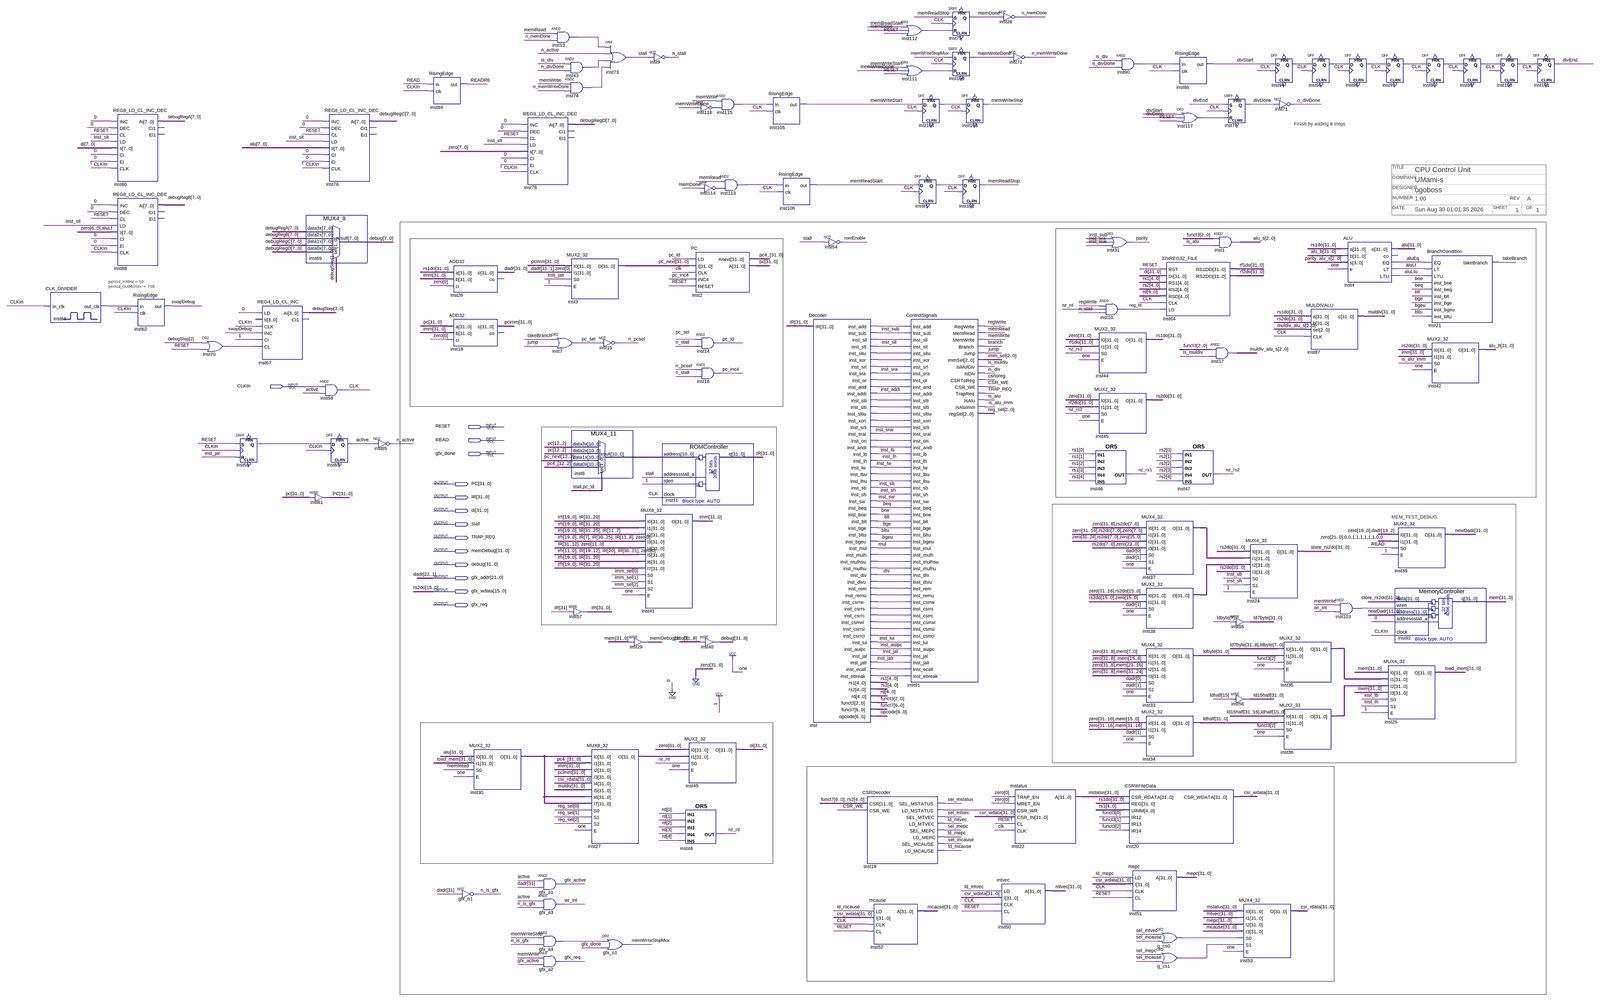
[diagram p0: schematic sheet, whole]
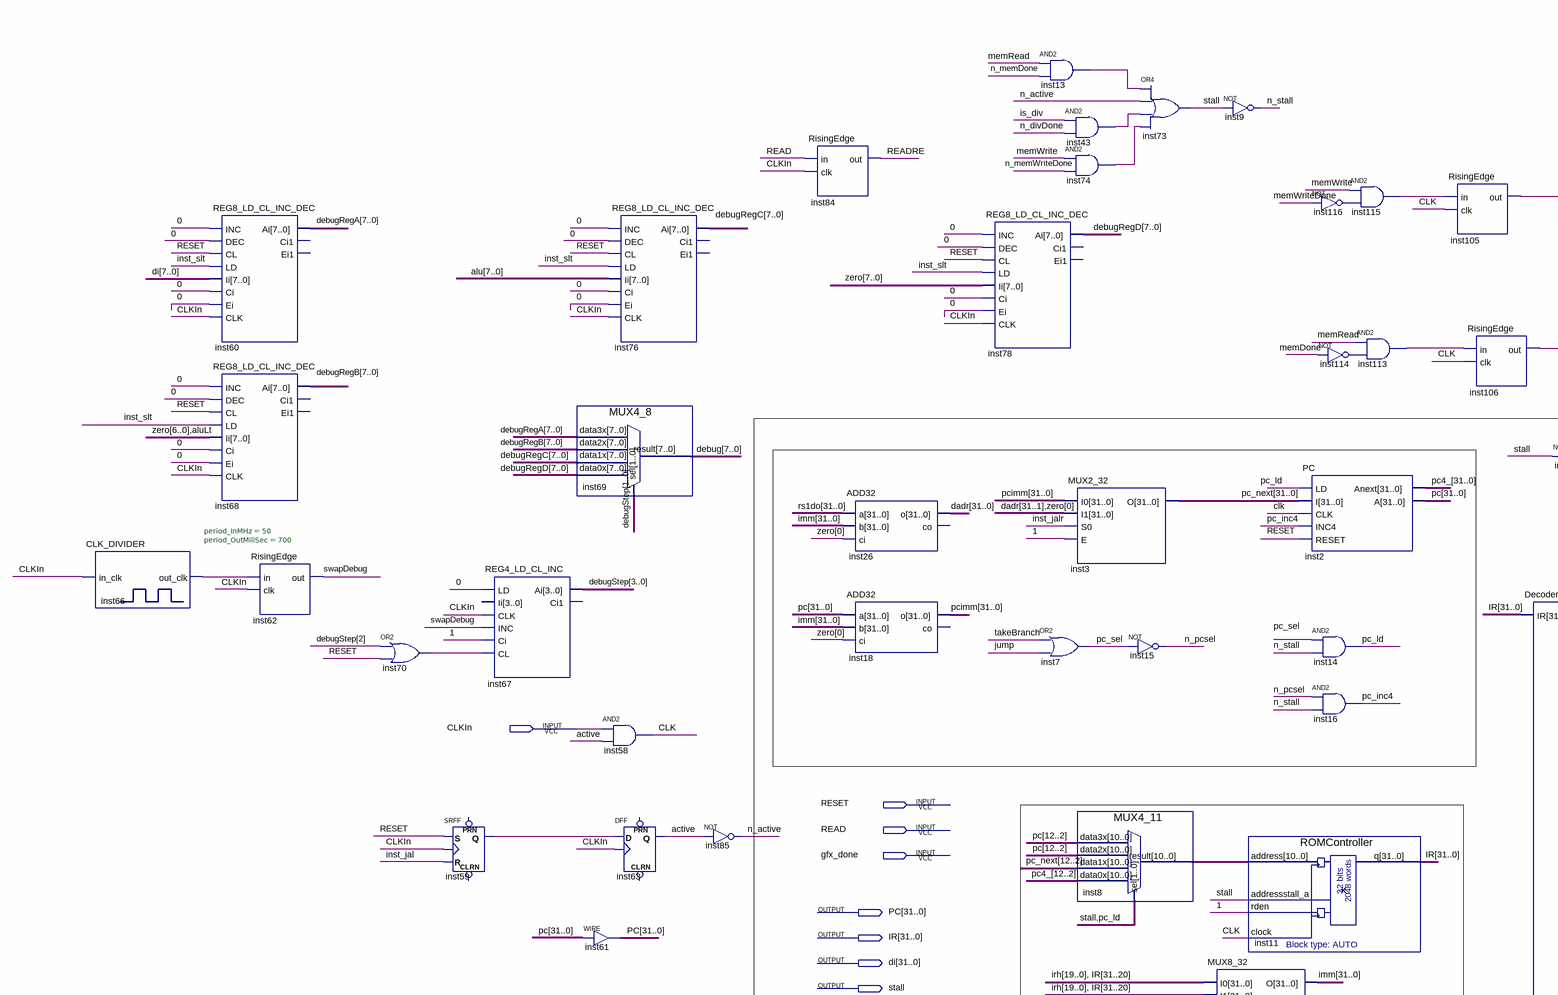
[diagram p1: schematic sheet, upper left part]
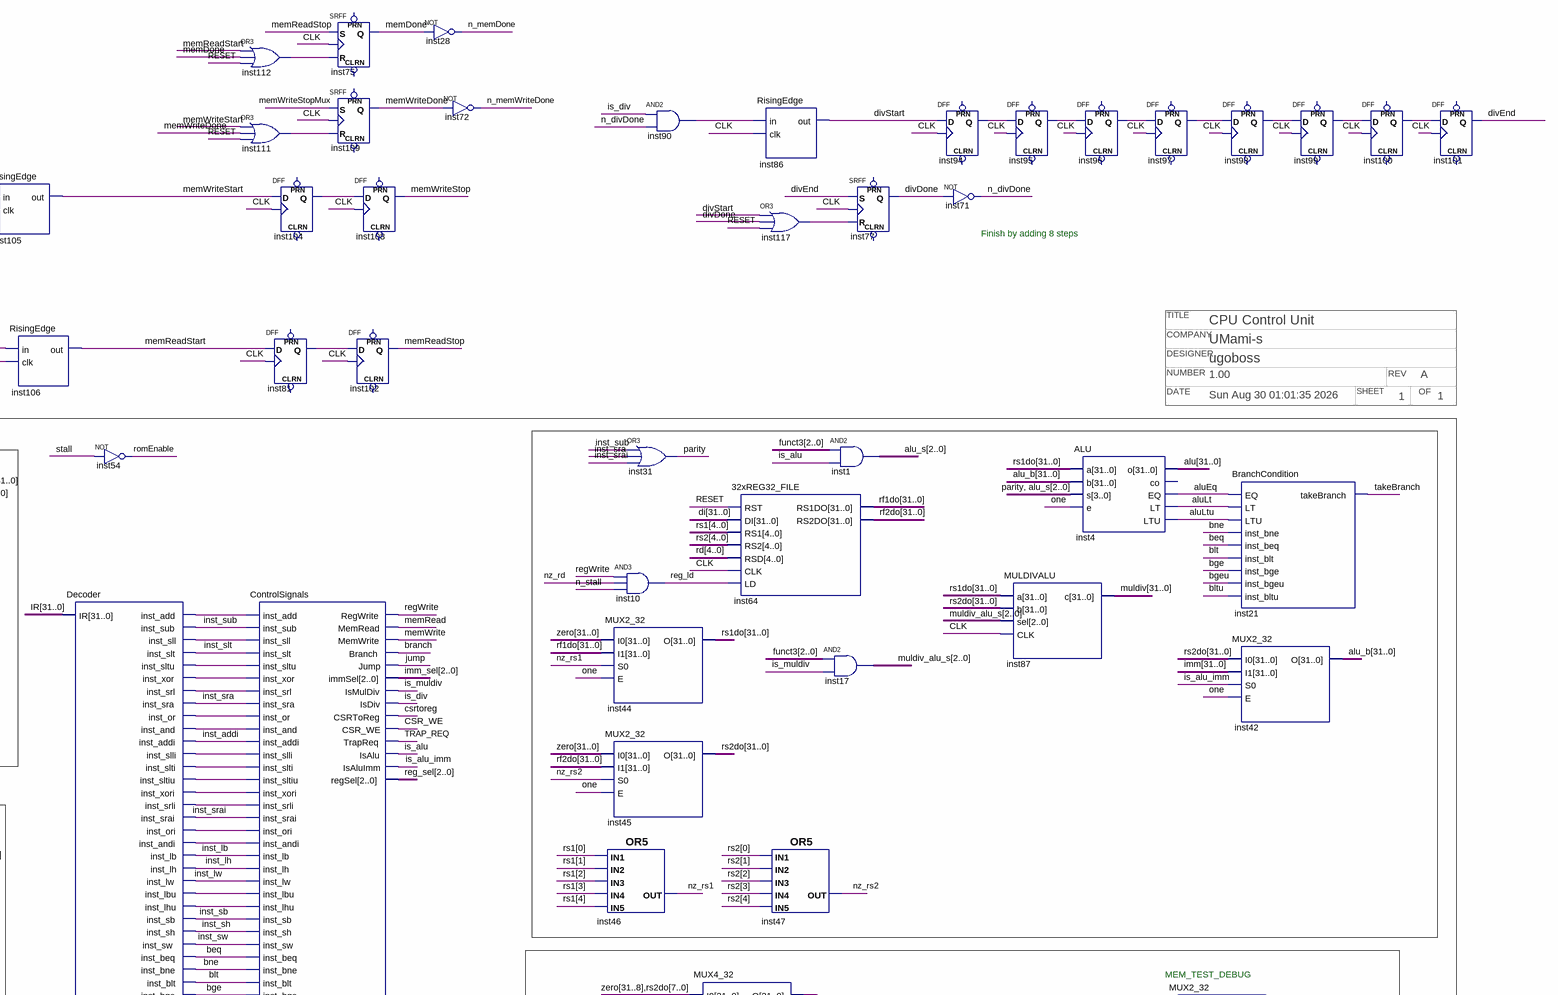
[diagram p2: schematic sheet, upper right part]
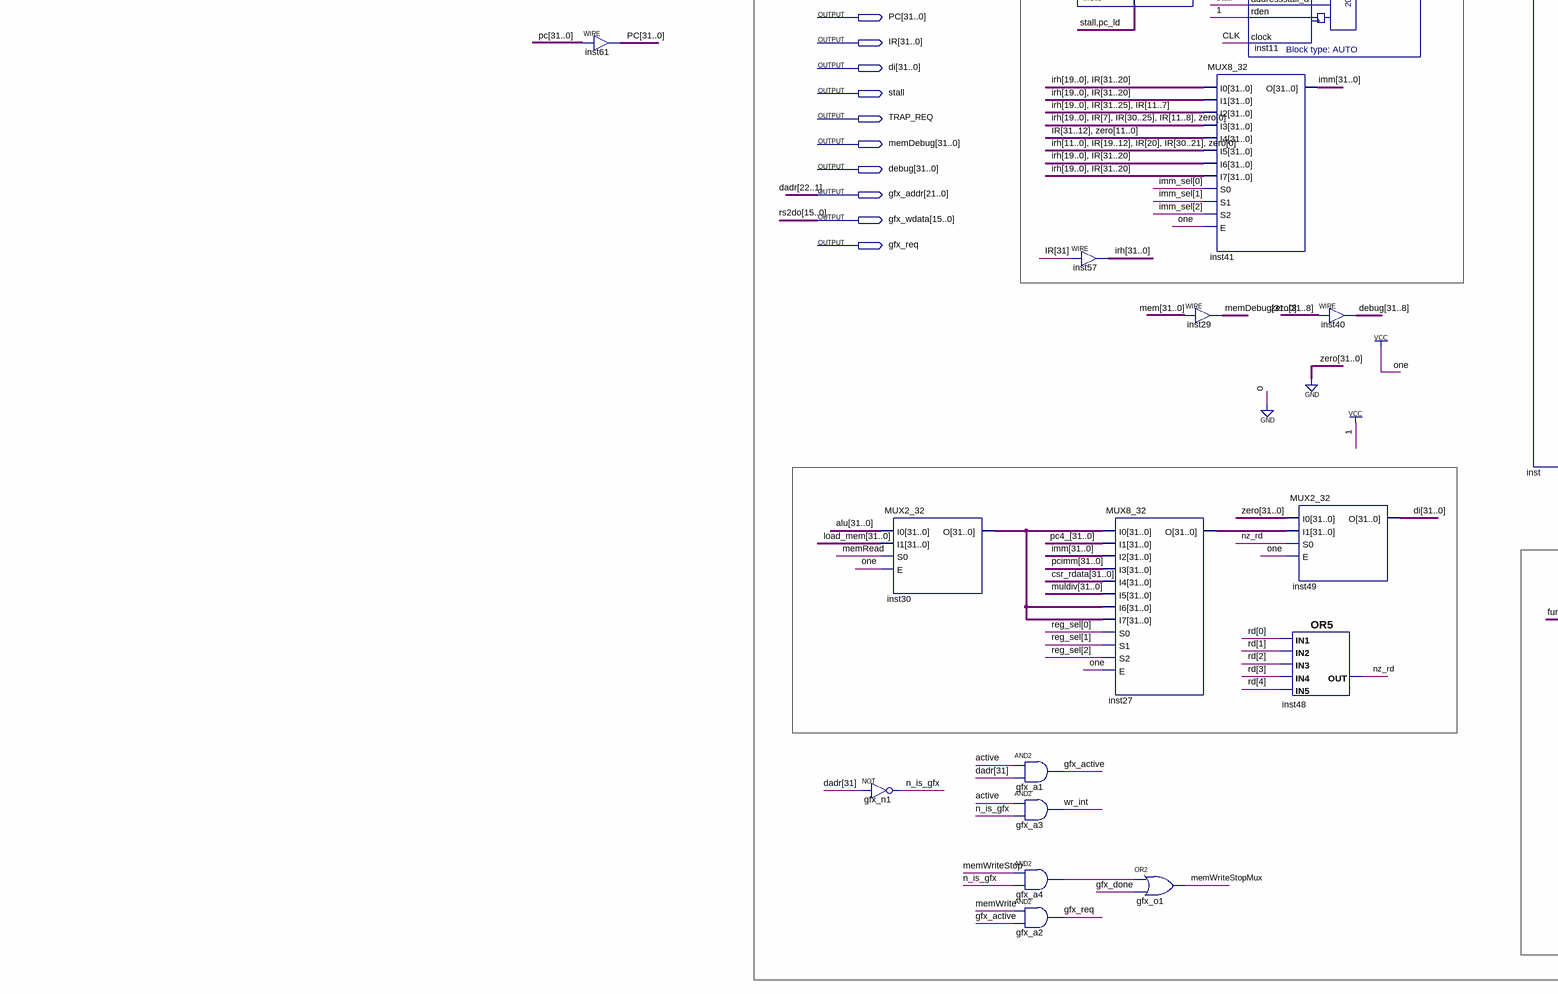
[diagram p3: schematic sheet, lower left part]
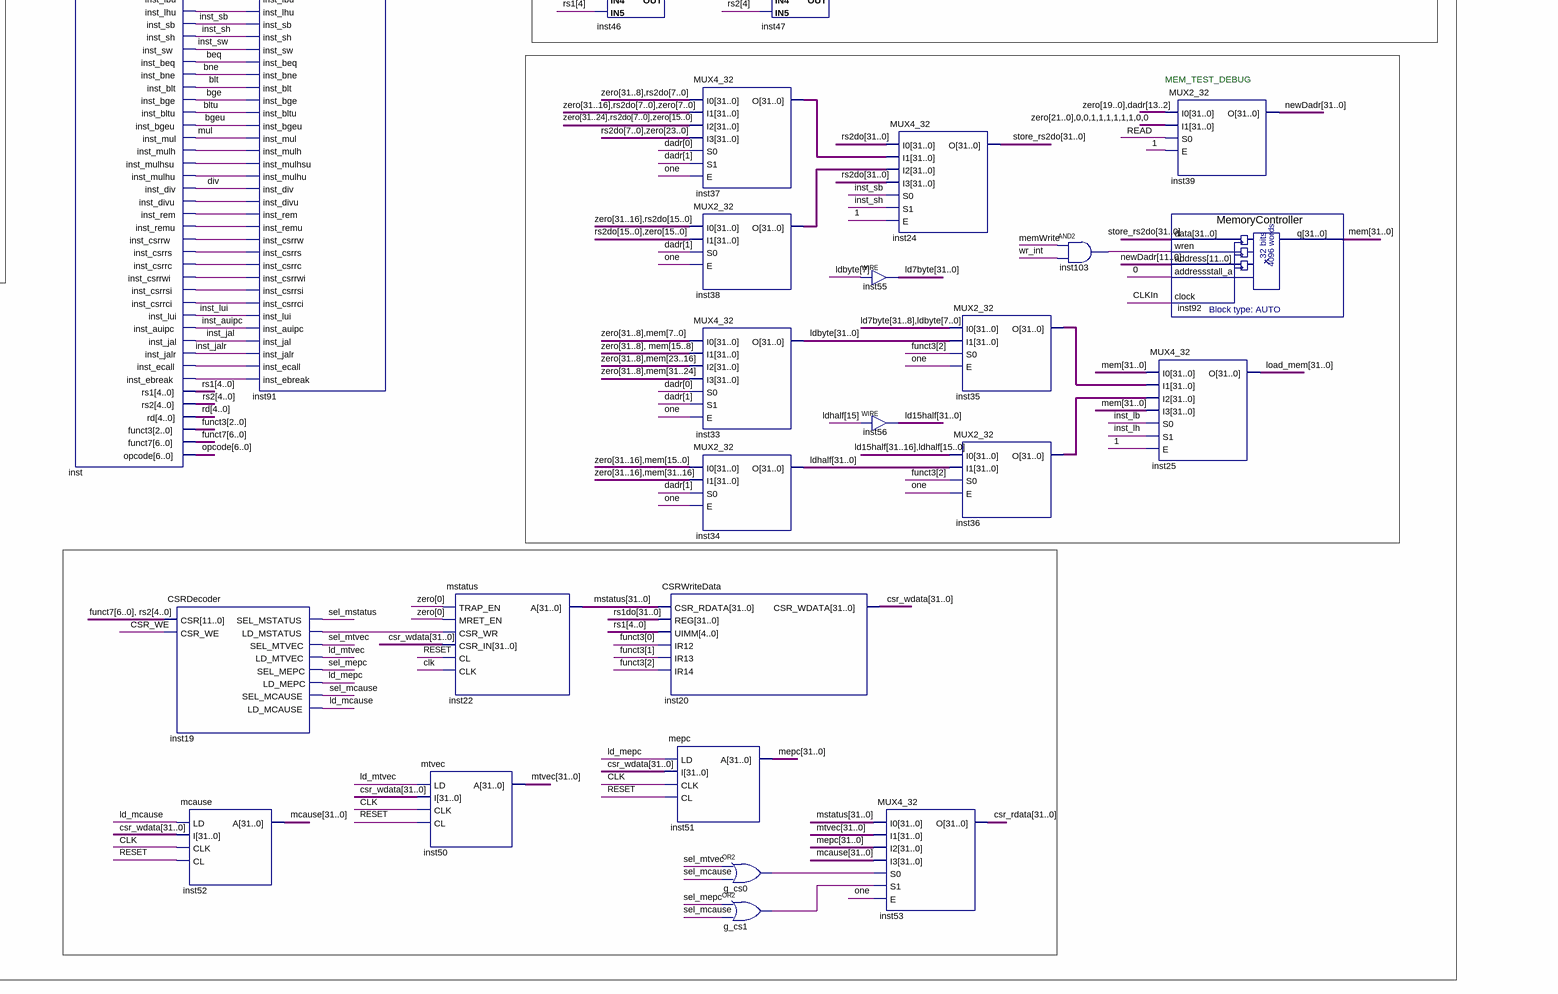
[diagram p4: schematic sheet, lower right part]
// Quartus schematic ControlUnit.bdf as structural Verilog: 111 symbols, 14 pins
// Title block: COMPANY: UMami-s; DATE: Sun Aug 30 01:01:35 2026; DESIGNER: ugoboss; NUMBER: 1.00; OF: 1; REV: A; SHEET: 1; TITLE: CPU Control Unit
module ControlUnit (
  input  CLKIn,
  input  RESET,
  input  READ,
  input  gfx_done,
  output [31:0] PC,
  output [31:0] IR,
  output [31:0] di,
  output stall,
  output TRAP_REQ,
  output [31:0] memDebug,
  output [31:0] debug,
  output [21:0] gfx_addr,
  output [15:0] gfx_wdata,
  output gfx_req
);

  wire active, aluEq, aluLt, aluLtu, beq, bge, bgeu, blt, bltu, bne, branch, CLK, CSR_WE, csrtoreg, div,
       divDone, divEnd, divStart, g_cs0_out, g_cs1_out, gfx_a4_out, gfx_active, inst13_out,
       inst19_ld_mstatus, inst43_out, inst59_q, inst66_out_clk, inst70_out, inst74_out, inst81_q, inst90_out,
       inst94_q, inst95_q, inst96_q, inst97_q, inst98_q, inst99_q, inst100_q, inst103_out, inst104_q,
       inst111_out, inst112_out, inst113_out, inst114_out, inst115_out, inst116_out, inst117_out, inst_addi,
       inst_auipc, inst_inst_add, inst_inst_and, inst_inst_andi, inst_inst_csrrc, inst_inst_csrrci,
       inst_inst_csrrs, inst_inst_csrrsi, inst_inst_csrrw, inst_inst_csrrwi, inst_inst_divu,
       inst_inst_ebreak, inst_inst_ecall, inst_inst_lbu, inst_inst_lhu, inst_inst_mulh, inst_inst_mulhsu,
       inst_inst_mulhu, inst_inst_or, inst_inst_ori, inst_inst_rem, inst_inst_remu, inst_inst_sll,
       inst_inst_slli, inst_inst_slti, inst_inst_sltiu, inst_inst_sltu, inst_inst_srl, inst_inst_srli,
       inst_inst_xor, inst_inst_xori, inst_jal, inst_jalr, inst_lb, inst_lh, inst_lui, inst_lw, inst_sb,
       inst_sh, inst_slt, inst_sra, inst_srai, inst_sub, inst_sw, is_alu, is_alu_imm, is_div, is_muldiv,
       jump, ld_mcause, ld_mepc, ld_mtvec, memDone, memRead, memReadStart, memReadStop, memWrite,
       memWriteDone, memWriteStart, memWriteStop, memWriteStopMux, mul, n_active, n_divDone, n_is_gfx,
       n_memDone, n_memWriteDone, n_pcsel, n_stall, nz_rd, nz_rs1, nz_rs2, parity, pc_inc4, pc_ld, pc_sel,
       READRE, reg_ld, regWrite, romEnable, sel_mcause, sel_mepc, sel_mstatus, sel_mtvec, swapDebug,
       takeBranch, wr_int;
  wire [2:0] alu_s, funct3, imm_sel, muldiv_alu_s, reg_sel;
  wire [3:0] debugStep;
  wire [4:0] rd, rs1, rs2;
  wire [6:0] funct7, opcode;
  wire [7:0] debugRegA, debugRegB, debugRegC, debugRegD;
  wire [10:0] inst8_result;
  wire [31:0] alu, alu_b, csr_rdata, csr_wdata, dadr, imm, inst27_o, inst30_o, inst35_o, inst36_o, inst37_o,
       inst38_o, irh, ld7byte, ld15half, ldbyte, ldhalf, load_mem, mcause, mem, mepc, mstatus, mtvec, muldiv,
       newDadr, pc4_, pc_next, pcimm, rf1do, rf2do, rs1do, store_rs2do;
  wire [31:16] rs2do;

  CLK_DIVIDER #(.period_InMHz(50), .period_OutMiliSec(700)) inst66 (.in_clk(CLKIn), .out_clk(inst66_out_clk));
  REG8_LD_CL_INC_DEC inst60 (
    .INC(1'b0), .DEC(1'b0), .CL(RESET), .LD(inst_slt), .Ii(di[7:0]), .Ci(1'b0), .Ei(1'b0), .CLK(CLKIn),
    .Ai(debugRegA));  // open: Ci1, Ei1
  REG8_LD_CL_INC_DEC inst68 (
    .INC(1'b0), .DEC(1'b0), .CL(RESET), .LD(inst_slt), .Ii({{7{1'b0}}, aluLt}), .Ci(1'b0), .Ei(1'b0),
    .CLK(CLKIn), .Ai(debugRegB));  // open: Ci1, Ei1
  RisingEdge inst62 (.in(inst66_out_clk), .clk(CLKIn), .out(swapDebug));
  or inst70 (inst70_out, debugStep[2], RESET);
  REG4_LD_CL_INC inst67 (
    .LD(1'b0), .CLK(CLKIn), .INC(swapDebug), .Ci(1'b1), .CL(inst70_out), .Ai(debugStep));  // open: Ii, Ci1
  SRFF inst59 (.S(RESET), .R(inst_jal), .CLK(CLKIn), .Q(inst59_q));  // open: PRN, CLRN
  MUX4_8 inst69 (
    .data3x(debugRegA), .data2x(debugRegB), .data1x(debugRegC), .data0x(debugRegD), .sel(debugStep[1:0]),
    .result(debug[7:0]));
  assign PC = PC;  // WIRE inst61
  REG8_LD_CL_INC_DEC inst76 (
    .INC(1'b0), .DEC(1'b0), .CL(RESET), .LD(inst_slt), .Ii(alu[7:0]), .Ci(1'b0), .Ei(1'b0), .CLK(CLKIn),
    .Ai(debugRegC));  // open: Ci1, Ei1
  and inst58 (CLK, CLKIn, active);
  DFF inst63 (.CLK(CLKIn), .D(inst59_q), .Q(active));  // open: CLRN, PRN
  not inst85 (n_active, active);
  RisingEdge inst84 (.in(READ), .clk(CLKIn), .out(READRE));
  ADD32 inst26 (.a(rs1do), .b(imm), .ci(1'b0), .o({dadr[31:23], gfx_addr, dadr[0]}));  // open: co
  ADD32 inst18 (.a(PC), .b(imm), .ci(1'b0), .o(pcimm));  // open: co
  MUX2_32 inst30 (.I0(alu), .I1(load_mem), .S0(memRead), .E(1'b1), .O(inst30_o));
  not gfx_n1 (n_is_gfx, dadr[31]);
  REG8_LD_CL_INC_DEC inst78 (
    .INC(1'b0), .DEC(1'b0), .CL(RESET), .LD(inst_slt), .Ii({8{1'b0}}), .Ci(1'b0), .Ei(1'b0), .CLK(CLKIn),
    .Ai(debugRegD));  // open: Ci1, Ei1
  and inst13 (inst13_out, memRead, n_memDone);
  or inst7 (pc_sel, takeBranch, jump);
  and gfx_a1 (gfx_active, active, dadr[31]);
  and gfx_a3 (wr_int, active, n_is_gfx);
  and gfx_a4 (gfx_a4_out, memWriteStop, n_is_gfx);
  and gfx_a2 (gfx_req, memWrite, gfx_active);
  and inst43 (inst43_out, is_div, n_divDone);
  and inst74 (inst74_out, memWrite, n_memWriteDone);
  MUX2_32 inst3 (.I0(pcimm), .I1({dadr[31:23], gfx_addr, 1'b0}), .S0(inst_jalr), .E(1'b1), .O(pc_next));
  MUX4_11 inst8 (
    .data3x(PC[12:2]), .data2x(PC[12:2]), .data1x(pc_next[12:2]), .data0x(pc4_[12:2]), .sel({stall, pc_ld}),
    .result(inst8_result));
  assign irh = {32{IR[31]}};  // WIRE inst57
  or inst73 (stall, inst13_out, n_active, inst43_out, inst74_out);
  not inst15 (n_pcsel, pc_sel);
  MUX8_32 inst27 (
    .I0(inst30_o), .I1(pc4_), .I2(imm), .I3(pcimm), .I4(csr_rdata), .I5(muldiv), .I6(inst30_o),
    .I7(inst30_o), .S0(reg_sel[0]), .S1(reg_sel[1]), .S2(reg_sel[2]), .E(1'b1), .O(inst27_o));
  or gfx_o1 (memWriteStopMux, gfx_a4_out, gfx_done);
  assign memDebug = mem;  // WIRE inst29
  not inst9 (n_stall, stall);
  ROMController inst11 (.address(inst8_result), .addressstall_a(stall), .rden(1'b1), .clock(CLK), .q(IR));
  MUX8_32 inst41 (
    .I0({irh[19:0], IR[31:20]}), .I1({irh[19:0], IR[31:20]}), .I2({irh[19:0], IR[31:25], IR[11:7]}),
    .I3({irh[19:0], IR[7], IR[30:25], IR[11:8], 1'b0}), .I4({IR[31:12], {12{1'b0}}}),
    .I5({irh[11:0], IR[19:12], IR[20], IR[30:21], 1'b0}), .I6({irh[19:0], IR[31:20]}),
    .I7({irh[19:0], IR[31:20]}), .S0(imm_sel[0]), .S1(imm_sel[1]), .S2(imm_sel[2]), .E(1'b1), .O(imm));
  PC inst2 (.LD(pc_ld), .I(pc_next), .CLK(CLK), .INC4(pc_inc4), .RESET(RESET), .Anext(pc4_), .A(PC));
  MUX2_32 inst49 (.I0({32{1'b0}}), .I1(inst27_o), .S0(nz_rd), .E(1'b1), .O(di));
  or inst48 (nz_rd, rd[0], rd[1], rd[2], rd[3], rd[4]);
  and inst115 (inst115_out, memWrite, inst116_out);
  not inst116 (inst116_out, memWriteDone);
  not inst114 (inst114_out, memDone);
  and inst14 (pc_ld, pc_sel, n_stall);
  and inst16 (pc_inc4, n_pcsel, n_stall);
  assign debug[31:8] = {24{1'b0}};  // WIRE inst40
  and inst113 (inst113_out, memRead, inst114_out);
  RisingEdge inst105 (.in(inst115_out), .clk(CLK), .out(memWriteStart));
  RisingEdge inst106 (.in(inst113_out), .clk(CLK), .out(memReadStart));
  not inst54 (romEnable, stall);
  Decoder inst (
    .IR(IR), .inst_add(inst_inst_add), .inst_sub(inst_sub), .inst_sll(inst_inst_sll), .inst_slt(inst_slt),
    .inst_sltu(inst_inst_sltu), .inst_xor(inst_inst_xor), .inst_srl(inst_inst_srl), .inst_sra(inst_sra),
    .inst_or(inst_inst_or), .inst_and(inst_inst_and), .inst_addi(inst_addi), .inst_slli(inst_inst_slli),
    .inst_slti(inst_inst_slti), .inst_sltiu(inst_inst_sltiu), .inst_xori(inst_inst_xori),
    .inst_srli(inst_inst_srli), .inst_srai(inst_srai), .inst_ori(inst_inst_ori), .inst_andi(inst_inst_andi),
    .inst_lb(inst_lb), .inst_lh(inst_lh), .inst_lw(inst_lw), .inst_lbu(inst_inst_lbu),
    .inst_lhu(inst_inst_lhu), .inst_sb(inst_sb), .inst_sh(inst_sh), .inst_sw(inst_sw), .inst_beq(beq),
    .inst_bne(bne), .inst_blt(blt), .inst_bge(bge), .inst_bltu(bltu), .inst_bgeu(bgeu), .inst_mul(mul),
    .inst_mulh(inst_inst_mulh), .inst_mulhsu(inst_inst_mulhsu), .inst_mulhu(inst_inst_mulhu), .inst_div(div),
    .inst_divu(inst_inst_divu), .inst_rem(inst_inst_rem), .inst_remu(inst_inst_remu),
    .inst_csrrw(inst_inst_csrrw), .inst_csrrs(inst_inst_csrrs), .inst_csrrc(inst_inst_csrrc),
    .inst_csrrwi(inst_inst_csrrwi), .inst_csrrsi(inst_inst_csrrsi), .inst_csrrci(inst_inst_csrrci),
    .inst_lui(inst_lui), .inst_auipc(inst_auipc), .inst_jal(inst_jal), .inst_jalr(inst_jalr),
    .inst_ecall(inst_inst_ecall), .inst_ebreak(inst_inst_ebreak), .rs1(rs1), .rs2(rs2), .rd(rd),
    .funct3(funct3), .funct7(funct7), .opcode(opcode));
  CSRDecoder inst19 (
    .CSR({funct7, rs2}), .CSR_WE(CSR_WE), .SEL_MSTATUS(sel_mstatus), .LD_MSTATUS(inst19_ld_mstatus),
    .SEL_MTVEC(sel_mtvec), .LD_MTVEC(ld_mtvec), .SEL_MEPC(sel_mepc), .LD_MEPC(ld_mepc),
    .SEL_MCAUSE(sel_mcause), .LD_MCAUSE(ld_mcause));
  mcause inst52 (.LD(ld_mcause), .I(csr_wdata), .CLK(CLK), .CL(RESET), .A(mcause));
  or inst112 (inst112_out, memReadStart, memDone, RESET);
  or inst111 (inst111_out, memWriteStart, memWriteDone, RESET);
  ControlSignals inst91 (
    .inst_add(inst_inst_add), .inst_sub(inst_sub), .inst_sll(inst_inst_sll), .inst_slt(inst_slt),
    .inst_sltu(inst_inst_sltu), .inst_xor(inst_inst_xor), .inst_srl(inst_inst_srl), .inst_sra(inst_sra),
    .inst_or(inst_inst_or), .inst_and(inst_inst_and), .inst_addi(inst_addi), .inst_slli(inst_inst_slli),
    .inst_slti(inst_inst_slti), .inst_sltiu(inst_inst_sltiu), .inst_xori(inst_inst_xori),
    .inst_srli(inst_inst_srli), .inst_srai(inst_srai), .inst_ori(inst_inst_ori), .inst_andi(inst_inst_andi),
    .inst_lb(inst_lb), .inst_lh(inst_lh), .inst_lw(inst_lw), .inst_lbu(inst_inst_lbu),
    .inst_lhu(inst_inst_lhu), .inst_sb(inst_sb), .inst_sh(inst_sh), .inst_sw(inst_sw), .inst_beq(beq),
    .inst_bne(bne), .inst_blt(blt), .inst_bge(bge), .inst_bltu(bltu), .inst_bgeu(bgeu), .inst_mul(mul),
    .inst_mulh(inst_inst_mulh), .inst_mulhsu(inst_inst_mulhsu), .inst_mulhu(inst_inst_mulhu), .inst_div(div),
    .inst_divu(inst_inst_divu), .inst_rem(inst_inst_rem), .inst_remu(inst_inst_remu),
    .inst_csrrw(inst_inst_csrrw), .inst_csrrs(inst_inst_csrrs), .inst_csrrc(inst_inst_csrrc),
    .inst_csrrwi(inst_inst_csrrwi), .inst_csrrsi(inst_inst_csrrsi), .inst_csrrci(inst_inst_csrrci),
    .inst_lui(inst_lui), .inst_auipc(inst_auipc), .inst_jal(inst_jal), .inst_jalr(inst_jalr),
    .inst_ecall(inst_inst_ecall), .inst_ebreak(inst_inst_ebreak), .RegWrite(regWrite), .MemRead(memRead),
    .MemWrite(memWrite), .Branch(branch), .Jump(jump), .immSel(imm_sel), .IsMulDiv(is_muldiv),
    .IsDiv(is_div), .CSRToReg(csrtoreg), .CSR_WE(CSR_WE), .TrapReq(TRAP_REQ), .IsAlu(is_alu),
    .IsAluImm(is_alu_imm), .regSel(reg_sel));
  DFF inst104 (.CLK(CLK), .D(memWriteStart), .Q(inst104_q));  // open: CLRN, PRN
  DFF inst81 (.CLK(CLK), .D(memReadStart), .Q(inst81_q));  // open: CLRN, PRN
  SRFF inst75 (.S(memReadStop), .R(inst112_out), .CLK(CLK), .Q(memDone));  // open: PRN, CLRN
  SRFF inst109 (.S(memWriteStopMux), .R(inst111_out), .CLK(CLK), .Q(memWriteDone));  // open: PRN, CLRN
  DFF inst102 (.CLK(CLK), .D(inst81_q), .Q(memReadStop));  // open: CLRN, PRN
  DFF inst108 (.CLK(CLK), .D(inst104_q), .Q(memWriteStop));  // open: CLRN, PRN
  not inst28 (n_memDone, memDone);
  not inst72 (n_memWriteDone, memWriteDone);
  mstatus inst22 (
    .TRAP_EN(1'b0), .MRET_EN(1'b0), .CSR_WR(inst19_ld_mstatus), .CSR_IN(csr_wdata), .CL(RESET), .CLK(CLK),
    .A(mstatus));
  mtvec inst50 (.LD(ld_mtvec), .I(csr_wdata), .CLK(CLK), .CL(RESET), .A(mtvec));
  MUX2_32 inst44 (.I0({32{1'b0}}), .I1(rf1do), .S0(nz_rs1), .E(1'b1), .O(rs1do));
  MUX2_32 inst45 (.I0({32{1'b0}}), .I1(rf2do), .S0(nz_rs2), .E(1'b1), .O({rs2do, gfx_wdata}));
  or inst46 (nz_rs1, rs1[0], rs1[1], rs1[2], rs1[3], rs1[4]);
  and inst90 (inst90_out, is_div, n_divDone);
  or inst31 (parity, inst_sub, inst_sra, inst_srai);
  and inst10 (reg_ld, regWrite, nz_rd, n_stall);
  MUX4_32 inst37 (
    .I0({{24{1'b0}}, gfx_wdata[7:0]}), .I1({{16{1'b0}}, gfx_wdata[7:0], {8{1'b0}}}),
    .I2({{8{1'b0}}, gfx_wdata[7:0], {16{1'b0}}}), .I3({gfx_wdata[7:0], {24{1'b0}}}), .S0(dadr[0]),
    .S1(gfx_addr[0]), .E(1'b1), .O(inst37_o));
  MUX2_32 inst38 (.I0({{16{1'b0}}, gfx_wdata}), .I1({gfx_wdata, {16{1'b0}}}), .S0(gfx_addr[0]), .E(1'b1), .O(inst38_o));
  MUX4_32 inst33 (
    .I0({{24{1'b0}}, mem[7:0]}), .I1({{24{1'b0}}, mem[15:8]}), .I2({{24{1'b0}}, mem[23:16]}),
    .I3({{24{1'b0}}, mem[31:24]}), .S0(dadr[0]), .S1(gfx_addr[0]), .E(1'b1), .O(ldbyte));
  MUX2_32 inst34 (.I0({{16{1'b0}}, mem[15:0]}), .I1({{16{1'b0}}, mem[31:16]}), .S0(gfx_addr[0]), .E(1'b1), .O(ldhalf));
  CSRWriteData inst20 (
    .CSR_RDATA(mstatus), .REG(rs1do), .UIMM(rs1), .IR12(funct3[0]), .IR13(funct3[1]), .IR14(funct3[2]),
    .CSR_WDATA(csr_wdata));
  mepc inst51 (.LD(ld_mepc), .I(csr_wdata), .CLK(CLK), .CL(RESET), .A(mepc));
  RisingEdge inst86 (.in(inst90_out), .clk(CLK), .out(divStart));
  \32xREG32_FILE  inst64 (
    .RST(RESET), .DI(di), .RS1(rs1), .RS2(rs2), .RSD(rd), .CLK(CLK), .LD(reg_ld), .RS1DO(rf1do), .RS2DO(rf2do));
  or g_cs0 (g_cs0_out, sel_mtvec, sel_mcause);
  or g_cs1 (g_cs1_out, sel_mepc, sel_mcause);
  or inst117 (inst117_out, divStart, divDone, RESET);
  or inst47 (nz_rs2, rs2[0], rs2[1], rs2[2], rs2[3], rs2[4]);
  SRFF inst77 (.S(divEnd), .R(inst117_out), .CLK(CLK), .Q(divDone));  // open: PRN, CLRN
  assign alu_s = funct3 & {3{is_alu}};  // AND2 inst1, 3 bits wide
  assign muldiv_alu_s = funct3 & {3{is_muldiv}};  // AND2 inst17, 3 bits wide
  MUX4_32 inst24 (
    .I0({rs2do, gfx_wdata}), .I1(inst37_o), .I2(inst38_o), .I3({rs2do, gfx_wdata}), .S0(inst_sb),
    .S1(inst_sh), .E(1'b1), .O(store_rs2do));
  assign ld7byte = {32{ldbyte[7]}};  // WIRE inst55
  assign ld15half = {32{ldhalf[15]}};  // WIRE inst56
  MUX4_32 inst53 (
    .I0(mstatus), .I1(mtvec), .I2(mepc), .I3(mcause), .S0(g_cs0_out), .S1(g_cs1_out), .E(1'b1), .O(csr_rdata));
  DFF inst94 (.CLK(CLK), .D(divStart), .Q(inst94_q));  // open: CLRN, PRN
  not inst71 (n_divDone, divDone);
  MUX2_32 inst35 (.I0({ld7byte[31:8], ldbyte[7:0]}), .I1(ldbyte), .S0(funct3[2]), .E(1'b1), .O(inst35_o));
  MUX2_32 inst36 (.I0({ld15half[31:16], ldhalf[15:0]}), .I1(ldhalf), .S0(funct3[2]), .E(1'b1), .O(inst36_o));
  DFF inst95 (.CLK(CLK), .D(inst94_q), .Q(inst95_q));  // open: CLRN, PRN
  MULDIVALU inst87 (.a(rs1do), .b({rs2do, gfx_wdata}), .sel(muldiv_alu_s), .CLK(CLK), .c(muldiv));
  and inst103 (inst103_out, memWrite, wr_int);
  DFF inst96 (.CLK(CLK), .D(inst95_q), .Q(inst96_q));  // open: CLRN, PRN
  ALU inst4 (
    .a(rs1do), .b(alu_b), .s({parity, alu_s}), .e(1'b1), .o(alu), .EQ(aluEq), .LT(aluLt), .LTU(aluLtu));  // open: co
  DFF inst97 (.CLK(CLK), .D(inst96_q), .Q(inst97_q));  // open: CLRN, PRN
  MUX4_32 inst25 (.I0(mem), .I1(inst35_o), .I2(inst36_o), .I3(mem), .S0(inst_lb), .S1(inst_lh), .E(1'b1), .O(load_mem));
  MUX2_32 inst39 (
    .I0({{20{1'b0}}, gfx_addr[12:1]}), .I1(32'b00000000000000000000000011111100), .S0(READ), .E(1'b1),
    .O(newDadr));
  MemoryController inst92 (
    .data(store_rs2do), .wren(inst103_out), .address(newDadr[11:0]), .addressstall_a(1'b0), .clock(CLKIn),
    .q(mem));
  DFF inst98 (.CLK(CLK), .D(inst97_q), .Q(inst98_q));  // open: CLRN, PRN
  BranchCondition inst21 (
    .EQ(aluEq), .LT(aluLt), .LTU(aluLtu), .inst_bne(bne), .inst_beq(beq), .inst_blt(blt), .inst_bge(bge),
    .inst_bgeu(bgeu), .inst_bltu(bltu), .takeBranch(takeBranch));
  MUX2_32 inst42 (.I0({rs2do, gfx_wdata}), .I1(imm), .S0(is_alu_imm), .E(1'b1), .O(alu_b));
  DFF inst99 (.CLK(CLK), .D(inst98_q), .Q(inst99_q));  // open: CLRN, PRN
  DFF inst100 (.CLK(CLK), .D(inst99_q), .Q(inst100_q));  // open: CLRN, PRN
  DFF inst101 (.CLK(CLK), .D(inst100_q), .Q(divEnd));  // open: CLRN, PRN

  // Other names for the same wires on the sheet: dadr[22:1] = gfx_addr; rs2do[15:0] = gfx_wdata

  // Notes on the sheet:
  //   Finish by adding 8 steps
  //   MEM_TEST_DEBUG
endmodule
